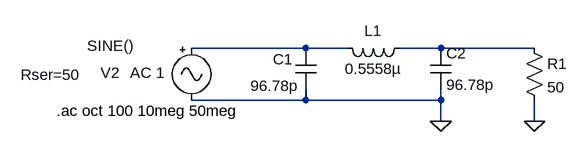
[diagram p0: schematic PiFilter.asc]
PiFilter.asc, the LTspice schematic file:
Version 4
SHEET 1 880 680
WIRE 160 128 -16 128
WIRE 224 128 160 128
WIRE 368 128 304 128
WIRE 512 128 368 128
WIRE 160 208 160 192
WIRE 160 208 -16 208
WIRE 368 208 368 192
WIRE 368 208 160 208
WIRE 368 240 368 208
WIRE 512 240 512 208
FLAG 368 240 0
FLAG 512 240 0
SYMBOL cap 144 128 R0
WINDOW 0 -35 17 Left 2
WINDOW 3 -69 58 Left 2
SYMATTR InstName C1
SYMATTR Value 96.78p
SYMBOL cap 352 128 R0
SYMATTR InstName C2
SYMATTR Value 96.78p
SYMBOL ind 320 112 R90
WINDOW 0 5 56 VBottom 2
WINDOW 3 32 56 VTop 2
SYMATTR InstName L1
SYMATTR Value 0.5558µ
SYMBOL Misc\\signal -16 112 R0
WINDOW 123 -95 54 Left 2
WINDOW 39 -263 57 Left 2
WINDOW 0 -140 54 Left 2
WINDOW 3 -161 12 Left 2
SYMATTR Value2 AC 1
SYMATTR SpiceLine Rser=50
SYMATTR InstName V2
SYMATTR Value SINE()
SYMBOL res 496 112 R0
SYMATTR InstName R1
SYMATTR Value 50
TEXT -224 224 Left 2 !.ac oct 100 10meg 50meg

The netlist it stands for:
* PiFilter.asc
C1 N001 0 96.78p
C2 N002 0 96.78p
L1 N002 N001 0.5558µ
V2 N001 0 SINE() AC 1 Rser=50
R1 N002 0 50
.ac oct 100 10meg 50meg
.backanno
.end